# EAGLE schematic eeZee_big_tiny (EAGLE 6.3)
DATABASE: ./../../../EAGLE/PARTSDB.TXT
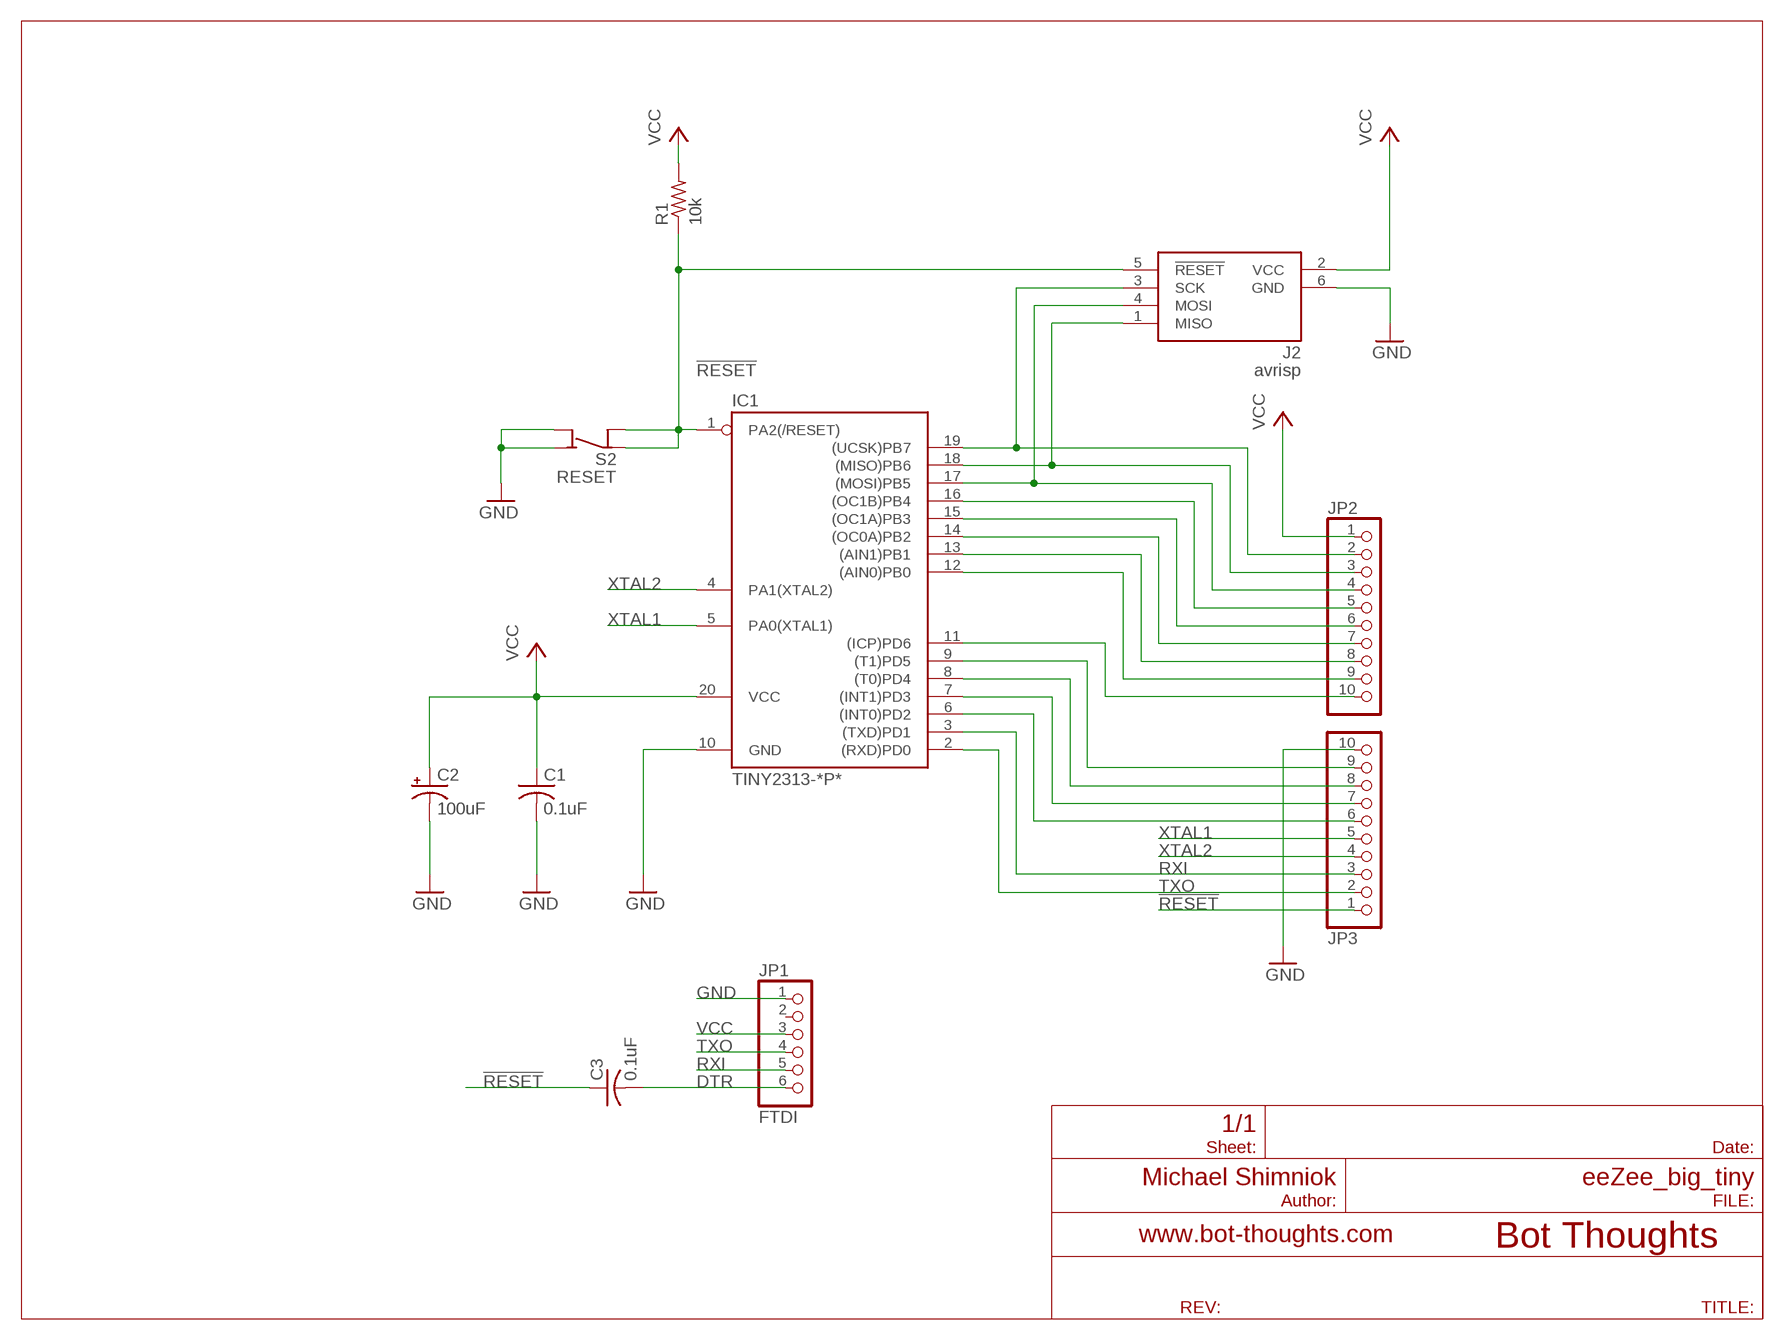
[diagram p0: schematic, sheet 1]

## Parts
C1  0.1uF  C-USC0603  [C0603]
C2  100uF  CPOL-USSMCB  [SMC_B]
C3  0.1uF  C-USC0603  [C0603]
IC1  TINY2313-*P*  [DIL20]
J2  avrisp  AVRISP6  [CON6P2R]
JP1  FTDI  PINHD-1X06_2.54-S  [1X06-S]
JP2  PINHD-1X10_2.54-S  [1X10-S]
JP3  PINHD-1X10_2.54-S  [1X10-S]
R1  10k  R-US_R0603  [R0603]
S2  RESET  SPST4  [6MMTACTILE_4PIN]

## Nets
!RESET: C3.1 IC1.1(PA2(/RESET)) J2.5(!RESET) JP3.1 R1.1 S2.B1(COM) S2.B2(COM)
DTR: C3.2 JP1.6
GND: C1.2 C2.- IC1.10(GND) J2.6(GND) JP1.1 JP3.10 S2.A1(NO) S2.A2(NO)
N$2: IC1.18((MISO)PB6) J2.1(MISO) JP2.3
N$3: IC1.17((MOSI)PB5) J2.4(MOSI) JP2.4
N$4: IC1.19((UCSK)PB7) J2.3(SCK) JP2.2
N$6: IC1.6((INT0)PD2) JP3.6
N$7: IC1.7((INT1)PD3) JP3.7
N$8: IC1.8((T0)PD4) JP3.8
N$9: IC1.9((T1)PD5) JP3.9
N$10: IC1.11((ICP)PD6) JP2.10
N$11: IC1.12((AIN0)PB0) JP2.9
N$12: IC1.13((AIN1)PB1) JP2.8
N$13: IC1.14((OC0A)PB2) JP2.7
N$14: IC1.15((OC1A)PB3) JP2.6
N$15: IC1.16((OC1B)PB4) JP2.5
RXI: IC1.3((TXD)PD1) JP1.5 JP3.3
TXO: IC1.2((RXD)PD0) JP1.4 JP3.2
VCC: C1.1 C2.+ IC1.20(VCC) J2.2(VCC) JP1.3 JP2.1 R1.2
XTAL1: IC1.5(PA0(XTAL1)) JP3.5
XTAL2: IC1.4(PA1(XTAL2)) JP3.4
Unconnected: JP1.2

## Library data of the parts
C1 C3 = rcl:C-US: CAPACITOR, American symbol; BOM: EXCLUDE; PARTNO: 0603YC104KAT2A
C2 = rcl:CPOL-US: POLARIZED CAPACITOR, American symbol; BOM: EXCLUDE; PARTNO: MCTT21X106M6R3CT
IC1 = avr-7:TINY2313*: Atmel Tiny2313 2K Flash, 128 bytes EEPROM, 128 bytes RAM
J2 = ads4:AVRISP6: 6-pin dual-row connector for Atmel AVRISP programmer interface
JP1 = pinhead-2:PINHD-1X06: PIN HEADER
JP2 JP3 = pinhead-2:PINHD-1X10: PIN HEADER
R1 = rcl:R-US_: RESISTOR, American symbol; PARTNO: ERJ-3GEYJ103V
S2 = mes_electromech:SPST4: SPST switch with 2 pins per contact